# Altium project Logic.PrjPcb
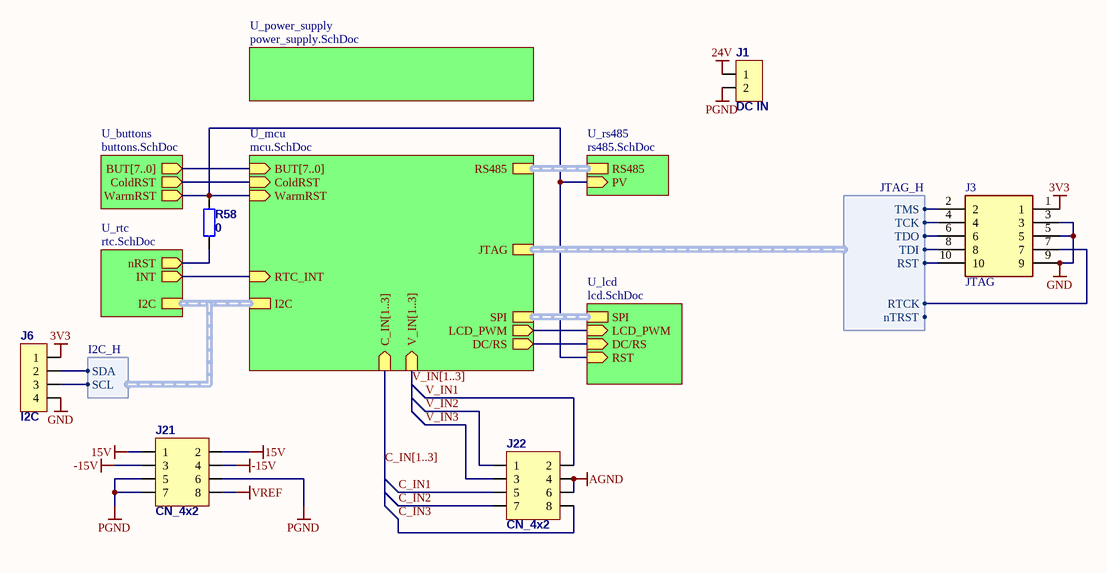
[diagram p0: main.SchDoc]
7 sheets, 162 parts. Net scope: hierarchical (ports join the sheet entries above them; power ports are global).
Board file: PCB1.PcbDoc
Sheets:
  main.SchDoc
    U_buttons = buttons.SchDoc
    U_mcu = mcu.SchDoc
    U_power_supply = power_supply.SchDoc
    U_rs485 = rs485.SchDoc
    U_rtc = rtc.SchDoc
    U_lcd = lcd.SchDoc

## Sheet main.SchDoc
size A4

### Parts
J1  DC IN  [15EDGRC-3.81/2P_WO_CN]
J3  JTAG  [FTSH-105-XX-YYY-DV-K-P-TR]
J6  I2C  [GP_4x1]
J21  CN_4x2  [GP_4x2]
J22  CN_4x2  [GP_4x2]
R58  0  [R0603]

### Sub-sheets
U_buttons = buttons.SchDoc: BUT[7..0] (out), ColdRST (out), WarmRST (out)
U_lcd = lcd.SchDoc: SPI (harness SPI_H), LCD_PWM (in), DC/RS (in), RST (in)
U_mcu = mcu.SchDoc: BUT[7..0] (in), I2C (harness I2C_H), JTAG (harness JTAG_H), SPI (harness SPI_H), RS485 (harness RS485_H), V_IN[1..3] (in), C_IN[1..3] (in), ColdRST (in), WarmRST (in), RTC_INT (in), LCD_PWM (out), DC/RS (out)
U_power_supply = power_supply.SchDoc: no entries
U_rs485 = rs485.SchDoc: PV (in), RS485 (harness RS485_H)
U_rtc = rtc.SchDoc: nRST (out), INT (out), I2C (harness I2C_H)

### Harnesses
JTAG_H: nTRST, RST, RTCK, TCK, TDI, TDO, TMS
I2C_H: SCL, SDA

### Nets
3V3: J3.1 J6.1
15V: J21.1 J21.2
24V: J1.1
-15V: J21.3 J21.4
AGND: J22.4 J22.6  [project net ADC_REF_L]
GND: J3.3 J3.5 J3.9 J6.4  [project net VSS]
PGND: J1.2 J21.5 J21.6 J21.7
VREF: J21.8
C_IN1: J22.5
C_IN2: J22.7
C_IN3: J22.8
DC/RS: sheet U_mcu/DC/RS, sheet U_lcd/DC/RS
LCD_PWM: sheet U_mcu/LCD_PWM, sheet U_lcd/LCD_PWM
nRST: J3.10 R58.2 ; sheet U_buttons/WarmRST, sheet U_mcu/WarmRST, sheet U_rs485/PV, sheet U_lcd/RST, sheet U_mcu/JTAG.RST
RTC_INT: sheet U_mcu/RTC_INT, sheet U_rtc/INT
TCK: J3.4 ; sheet U_mcu/JTAG.TCK
TDI: J3.8 ; sheet U_mcu/JTAG.TDI
TMS: J3.2 ; sheet U_mcu/JTAG.TMS
V_IN1: J22.2
V_IN2: J22.1
V_IN3: J22.3
NetColdRST_2: sheet U_buttons/ColdRST, sheet U_mcu/ColdRST
NetJ3_6: J3.6 ; sheet U_mcu/JTAG.TDO
NetJ3_7: J3.7 ; sheet U_mcu/JTAG.RTCK
NetJ6_2: J6.2 ; sheet U_mcu/I2C.SDA
NetJ6_3: J6.3 ; sheet U_mcu/I2C.SCL
NetR58_1: R58.1 ; sheet U_rtc/nRST

### Buses and harness runs
bus C_IN[1..3] = sheet U_mcu/C_IN[1..3]
bus sheet U_buttons/BUT[7..0] = sheet U_mcu/BUT[7..0]
bus V_IN[1..3] = sheet U_mcu/V_IN[1..3]
harness sheet U_lcd/SPI = sheet U_mcu/SPI
harness sheet U_mcu/I2C = sheet U_rtc/I2C
harness sheet U_mcu/RS485 = sheet U_rs485/RS485

### Library data of the parts
J1 = CN_2x1
J3 = FTSH-105-01-L-DV-K-P-TR: Connector; Manufacturer_Name: SAMTEC; Datasheet Link: http://suddendocs.samtec.com/prints/ftsh-1xx-xx-xxx-dv-xxx-xxx-mkt.pdf; Manufacturer_Part_Number: FTSH-105-01-L-DV-K-P-TR
J6 = CN_4x1
R58 = Res: Resistor; Published: 19-Feb-2006; ComponentLink1Description: datasheet; ComponentLink2Description: supplier; Value: 0

## Sheet buttons.SchDoc
size A4
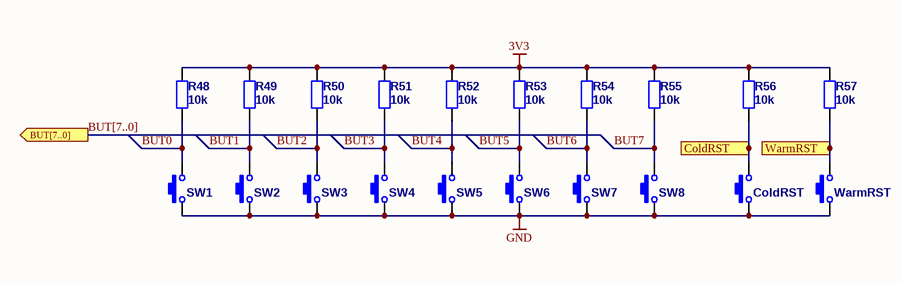
[diagram p1: buttons.SchDoc]

### Parts
ColdRST  TACTM-67N-F  [DTSM-6]  (value not drawn)
R48  10k  [R0603]
R49  10k  [R0603]
R50  10k  [R0603]
R51  10k  [R0603]
R52  10k  [R0603]
R53  10k  [R0603]
R54  10k  [R0603]
R55  10k  [R0603]
R56  10k  [R0603]
R57  10k  [R0603]
SW1  TACTM-67N-F  [DTSM-6]  (value not drawn)
SW2  TACTM-67N-F  [DTSM-6]  (value not drawn)
SW3  TACTM-67N-F  [DTSM-6]  (value not drawn)
SW4  TACTM-67N-F  [DTSM-6]  (value not drawn)
SW5  TACTM-67N-F  [DTSM-6]  (value not drawn)
SW6  TACTM-67N-F  [DTSM-6]  (value not drawn)
SW7  TACTM-67N-F  [DTSM-6]  (value not drawn)
SW8  TACTM-67N-F  [DTSM-6]  (value not drawn)
WarmRST  TACTM-67N-F  [DTSM-6]  (value not drawn)

### Ports
BUT[7..0] (out), ColdRST (out), WarmRST (out)

### Nets
3V3: R48.2 R49.2 R50.2 R51.2 R52.2 R53.2 R54.2 R55.2 R56.2 R57.2
GND: ColdRST.1 SW1.1 SW2.1 SW3.1 SW4.1 SW5.1 SW6.1 SW7.1 SW8.1 WarmRST.1  [project net VSS]
BUT0: R48.1 SW1.2
BUT1: R49.1 SW2.2
BUT2: R50.1 SW3.2
BUT3: R51.1 SW4.2
BUT4: R52.1 SW5.2
BUT5: R53.1 SW6.2
BUT6: R54.1 SW7.2
BUT7: R55.1 SW8.2
nRST: R57.1 WarmRST.2 ; port WarmRST
NetColdRST_2: ColdRST.2 R56.1 ; port ColdRST

### Buses and harness runs
bus BUT[7..0] = port BUT[7..0]

### Library data of the parts
ColdRST SW1-SW8 WarmRST = TACTM-67N-F: 6x6mm SMD Tactile SPST-NO Switch
R48-R57 = Res: Resistor; Published: 19-Feb-2006; ComponentLink1Description: datasheet; ComponentLink2Description: supplier; Value: 10k

## Sheet mcu.SchDoc
size A3
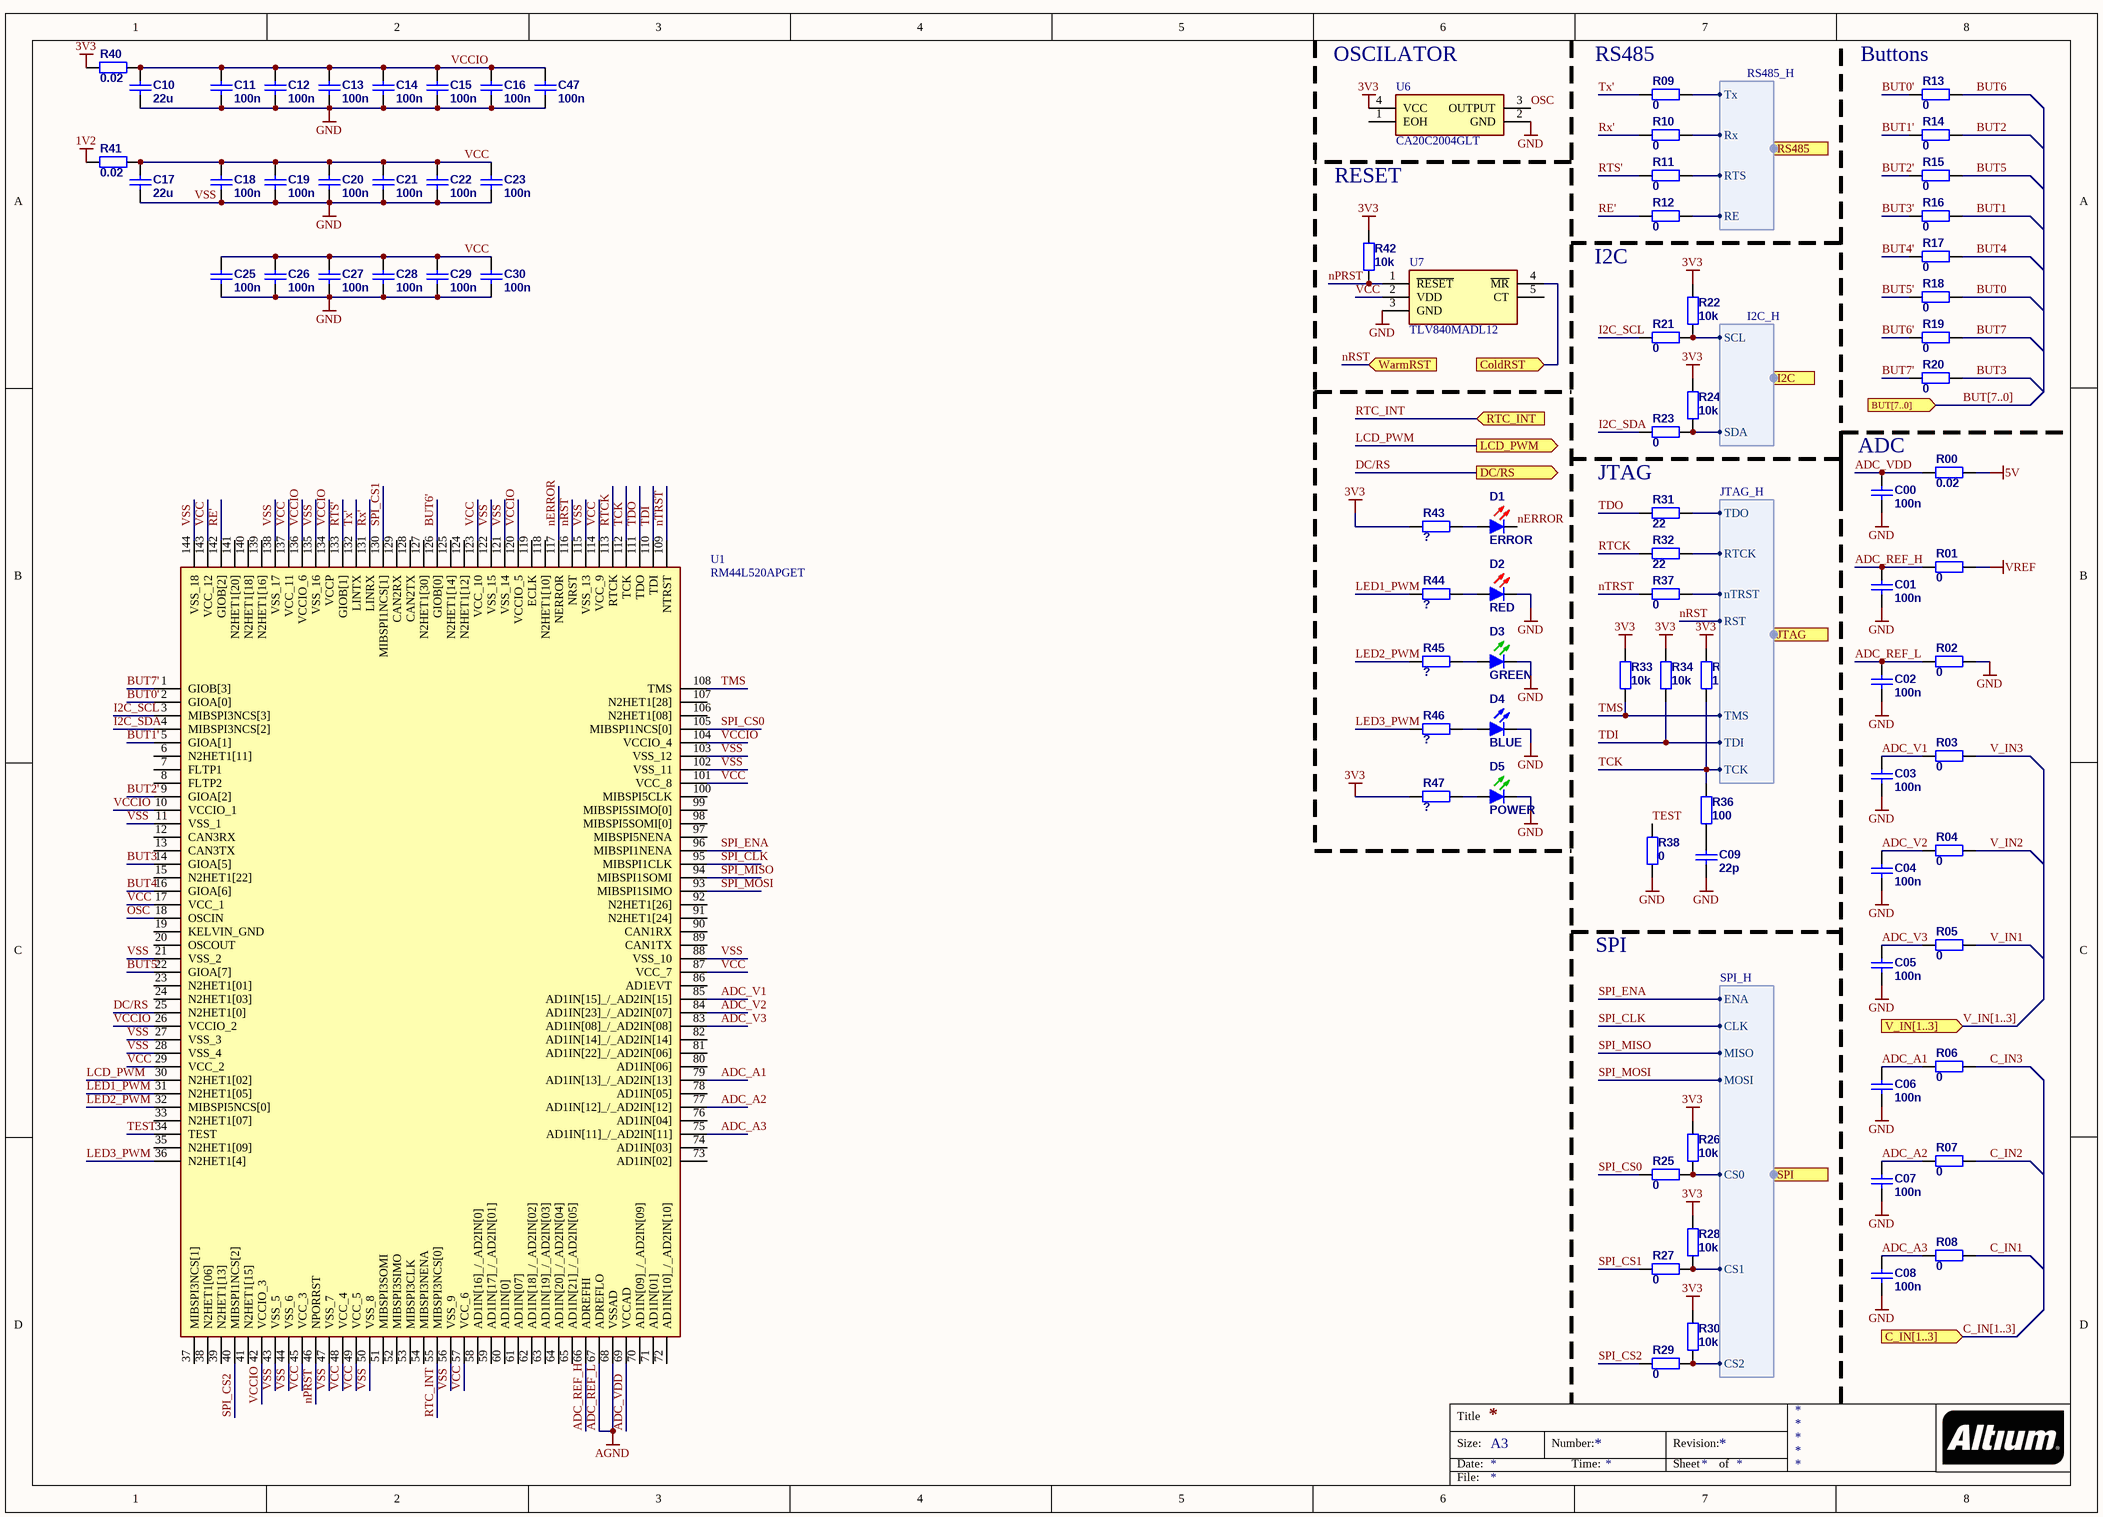
[diagram p2: mcu.SchDoc]

### Parts
C00  100n  [C0402]
C01  100n  [C0402]
C02  100n  [C0402]
C03  100n  [C0402]
C04  100n  [C0402]
C05  100n  [C0402]
C06  100n  [C0402]
C07  100n  [C0402]
C08  100n  [C0402]
C09  22p  [C0402]
C10  22u  [C0603]
C11  100n  [C0402]
C12  100n  [C0402]
C13  100n  [C0402]
C14  100n  [C0402]
C15  100n  [C0402]
C16  100n  [C0402]
C17  22u  [C0603]
C18  100n  [C0402]
C19  100n  [C0402]
C20  100n  [C0402]
C21  100n  [C0402]
C22  100n  [C0402]
C23  100n  [C0402]
C25  100n  [C0402]
C26  100n  [C0402]
C27  100n  [C0402]
C28  100n  [C0402]
C29  100n  [C0402]
C30  100n  [C0402]
C47  100n  [C0402]
D1  ERROR  [LED1206R]
D2  RED  [LED1206R]
D3  GREEN  [LED1206G]
D4  BLUE  [LED1206B]
D5  POWER  [LED1206G]
R00  0.02  [R0402]
R01  0  [R0402]
R02  0  [R0402]
R03  0  [R0402]
R04  0  [R0402]
R05  0  [R0402]
R06  0  [R0402]
R07  0  [R0402]
R08  0  [R0402]
R09  0  [R0402]
R10  0  [R0402]
R11  0  [R0402]
R12  0  [R0402]
R13  0  [R0402]
R14  0  [R0402]
R15  0  [R0402]
R16  0  [R0402]
R17  0  [R0402]
R18  0  [R0402]
R19  0  [R0402]
R20  0  [R0402]
R21  0  [R0402]
R22  10k  [R0402]
R23  0  [R0402]
R24  10k  [R0402]
R25  0  [R0402]
R26  10k  [R0402]
R27  0  [R0402]
R28  10k  [R0402]
R29  0  [R0402]
R30  10k  [R0402]
R31  22  [R0402]
R32  22  [R0402]
R33  10k  [R0402]
R34  10k  [R0402]
R35  10k  [R0402]
R36  100  [R0402]
R37  0  [R0402]
R38  0  [R0402]
R40  0.02  [R0603]
R41  0.02  [R0603]
R42  10k  [R0402]
R43  ?  [R0603]
R44  ?  [R0402]
R45  ?  [R0402]
R46  ?  [R0402]
R47  ?  [R0603]
U1  RM44L520APGET  [QFP50P2200X2200X160-144N]
U6  CA20C2004GLT  [CA20C2004GLT]
U7  TLV840MADL12  [SOT95P280X145-5N]

### Ports
BUT[7..0] (in), C_IN[1..3] (in), ColdRST (in), DC/RS (out), I2C (in, harness I2C_H), JTAG (in, harness JTAG_H), LCD_PWM (out), RS485 (in, harness RS485_H), RTC_INT (in), SPI (in, harness SPI_H), V_IN[1..3] (in), WarmRST (in)

### Harnesses
RS485_H: Tx, Rx, RTS, RE
I2C_H: SCL, SDA
JTAG_H: TDO, RTCK, nTRST, TMS, TCK, TDI, RST
SPI_H: ENA, CLK, MISO, MOSI, CS0, CS1, CS2

### Nets
1V2: R41.1
3V3: R22.2 R24.1 R26.2 R28.2 R30.1 R33.2 R34.2 R35.2 R40.1 R42.2 R43.2 R47.2 U6.4(VCC)
5V: R00.2
ADC_REF_L: C02.2 R02.1 U1.67(ADREFLO) U1.68(VSSAD)  [also labelled AGND]
VREF: R01.2
VSS: C00.1 C01.1 C02.1 C03.1 C04.1 C05.1 C06.1 C07.1 C08.1 C09.1 C10.1 C11.1 C12.1 C13.1 C14.1 C15.1 C16.1 C17.1 C18.1 C19.1 C20.1 C21.1 C22.1 C23.1 C25.1 C26.1 C27.1 C28.1 C29.1 C30.1 C47.1 D2.2(K) D3.2(K) D4.2(K) D5.2(K) R02.2 R38.1 U1.11(VSS_1) U1.21(VSS_2) U1.27(VSS_3) U1.28(VSS_4) U1.43(VSS_5) U1.44(VSS_6) U1.47(VSS_7) U1.50(VSS_8) U1.56(VSS_9) U1.88(VSS_10) U1.102(VSS_11) U1.103(VSS_12) U1.115(VSS_13) U1.121(VSS_14) U1.122(VSS_15) U1.135(VSS_16) U1.138(VSS_17) U1.144(VSS_18) U6.2(GND) U7.3(GND)  [also labelled GND]
ADC_A1: C06.2 R06.1 U1.79(AD1IN[13]_/_AD2IN[13])
ADC_A2: C07.2 R07.1 U1.77(AD1IN[12]_/_AD2IN[12])
ADC_A3: C08.2 R08.1 U1.75(AD1IN[11]_/_AD2IN[11])
ADC_REF_H: C01.2 R01.1 U1.66(ADREFHI)
ADC_V1: C03.2 R03.1 U1.85(AD1IN[15]_/_AD2IN[15])
ADC_V2: C04.2 R04.1 U1.84(AD1IN[23]_/_AD2IN[07])
ADC_V3: C05.2 R05.1 U1.83(AD1IN[08]_/_AD2IN[08])
ADC_VDD: C00.2 R00.1 U1.69(VCCAD)
BUT0: R18.2
BUT0': R13.1 U1.2(GIOA[0])
BUT1: R16.2
BUT1': R14.1 U1.5(GIOA[1])
BUT2: R14.2
BUT2': R15.1 U1.9(GIOA[2])
BUT3: R20.2
BUT3': R16.1 U1.14(GIOA[5])
BUT4: R17.2
BUT4': R17.1 U1.16(GIOA[6])
BUT5: R15.2
BUT5': R18.1 U1.22(GIOA[7])
BUT6: R13.2
BUT6': R19.1 U1.126(GIOB[0])
BUT7: R19.2
BUT7': R20.1 U1.1(GIOB[3])
C_IN1: R08.2
C_IN2: R07.2
C_IN3: R06.2
DC/RS: U1.25(N2HET1[0]) ; port DC/RS
I2C_SCL: R21.1 U1.3(MIBSPI3NCS[3])
I2C_SDA: R23.2 U1.4(MIBSPI3NCS[2])
LCD_PWM: U1.30(N2HET1[02]) ; port LCD_PWM
LED1_PWM: R44.2 U1.31(N2HET1[05])
LED2_PWM: R45.2 U1.32(MIBSPI5NCS[0])
LED3_PWM: R46.2 U1.36(N2HET1[4])
nERROR: D1.2(K) U1.117(NERROR)
nPRST: R42.1 U1.46(NPORRST) U7.1(~{RESET})
nRST: U1.116(NRST) ; port WarmRST, port JTAG.RST
nTRST: R37.1 U1.109(NTRST)
OSC: U1.18(OSCIN) U6.3(OUTPUT)
RE': R12.1 U1.142(GIOB[2])
RTC_INT: U1.55(MIBSPI3NCS[0]) ; port RTC_INT
RTCK: R32.1 U1.113(RTCK)
RTS': R11.1 U1.133(GIOB[1])
Rx': R10.1 U1.131(LINRX)
SPI_CLK: U1.95(MIBSPI1CLK) ; port SPI.CLK
SPI_CS0: R25.1 U1.105(MIBSPI1NCS[0])
SPI_CS1: R27.2 U1.130(MIBSPI1NCS[1])
SPI_CS2: R29.2 U1.40(MIBSPI1NCS[2])
SPI_ENA: U1.96(MIBSPI1NENA) ; port SPI.ENA
SPI_MISO: U1.94(MIBSPI1SOMI) ; port SPI.MISO
SPI_MOSI: U1.93(MIBSPI1SIMO) ; port SPI.MOSI
TCK: R35.1 R36.2 U1.112(TCK) ; port JTAG.TCK
TDI: R34.1 U1.110(TDI) ; port JTAG.TDI
TDO: R31.1 U1.111(TDO)
TEST: R38.2 U1.34(TEST)
TMS: R33.1 U1.108(TMS) ; port JTAG.TMS
Tx': R09.1 U1.132(LINTX)
V_IN1: R05.2
V_IN2: R04.2
V_IN3: R03.2
VCC: C17.2 C18.2 C19.2 C20.2 C21.2 C22.2 C23.2 C25.2 C26.2 C27.2 C28.2 C29.2 C30.2 R41.2 U1.17(VCC_1) U1.29(VCC_2) U1.45(VCC_3) U1.48(VCC_4) U1.49(VCC_5) U1.57(VCC_6) U1.87(VCC_7) U1.101(VCC_8) U1.114(VCC_9) U1.123(VCC_10) U1.137(VCC_11) U1.143(VCC_12) U7.2(VDD)
VCCIO: C10.2 C11.2 C12.2 C13.2 C14.2 C15.2 C16.2 C47.2 R40.2 U1.10(VCCIO_1) U1.26(VCCIO_2) U1.42(VCCIO_3) U1.104(VCCIO_4) U1.120(VCCIO_5) U1.134(VCCP) U1.136(VCCIO_6)
NetC09_2: C09.2 R36.1
NetColdRST_2: U7.4(~{MR}) ; port ColdRST
NetD1_1: D1.1(A) R43.1
NetD2_1: D2.1(A) R44.1
NetD3_1: D3.1(A) R45.1
NetD4_1: D4.1(A) R46.1
NetD5_1: D5.1(A) R47.1
NetJ3_6: R31.2 ; port JTAG.TDO
NetJ3_7: R32.2 ; port JTAG.RTCK
NetJ5_3: R25.2 R26.1 ; port SPI.CS0
NetJ6_2: R23.1 R24.2 ; port I2C.SDA
NetJ6_3: R21.2 R22.1 ; port I2C.SCL
NetR09_2: R09.2 ; port RS485.Tx
NetR10_2: R10.2 ; port RS485.Rx
NetR11_2: R11.2 ; port RS485.RTS
NetR12_2: R12.2 ; port RS485.RE
NetR27_1: R27.1 R28.1 ; port SPI.CS1
NetR29_1: R29.1 R30.2 ; port SPI.CS2
NetR37_2: R37.2 ; port JTAG.nTRST

Not connected (* = marked no-connect by the designer): U1 6(N2HET1[11]) 7(FLTP1) 8(FLTP2) 12(CAN3RX) 13(CAN3TX) 15(N2HET1[22]) 19(KELVIN_GND) 20(OSCOUT) 23(N2HET1[01]) 24(N2HET1[03]) 33(N2HET1[07]) 35(N2HET1[09]) 37(MIBSPI3NCS[1]) 38(N2HET1[06]) 39(N2HET1[13]) 41(N2HET1[15]) 51(MIBSPI3SOMI) 52(MIBSPI3SIMO) 53(MIBSPI3CLK) 54(MIBSPI3NENA) 58(AD1IN[16]_/_AD2IN[0]) 59(AD1IN[17]_/_AD2IN[01]) 60(AD1IN[0]) 61(AD1IN[07]) 62(AD1IN[18]_/_AD2IN[02]) 63(AD1IN[19]_/_AD2IN[03]) 64(AD1IN[20]_/_AD2IN[04]) 65(AD1IN[21]_/_AD2IN[05]) 70(AD1IN[09]_/_AD2IN[09]) 71(AD1IN[01]) 72(AD1IN[10]_/_AD2IN[10]) 73(AD1IN[02]) 74(AD1IN[03]) 76(AD1IN[04]) 78(AD1IN[05]) 80(AD1IN[06]) 81(AD1IN[22]_/_AD2IN[06]) 82(AD1IN[14]_/_AD2IN[14]) 86(AD1EVT) 89(CAN1TX) 90(CAN1RX) 91(N2HET1[24]) 92(N2HET1[26]) 97(MIBSPI5NENA) 98(MIBSPI5SOMI[0]) 99(MIBSPI5SIMO[0]) 100(MIBSPI5CLK) 106(N2HET1[08]) 107(N2HET1[28]) 118(N2HET1[10]) 119(ECLK) 124(N2HET1[12]) 125(N2HET1[14]) 127(N2HET1[30]) 128(CAN2TX) 129(CAN2RX) 139(N2HET1[16]) 140(N2HET1[18]) 141(N2HET1[20]); U6 1(EOH); U7 5(CT)

### Buses and harness runs
bus BUT[7..0] = port BUT[7..0]
bus C_IN[1..3] = port C_IN[1..3]
bus V_IN[1..3] = port V_IN[1..3]

### Notes on the sheet
- (near U6) OSCILATOR
- (near R09) RS485
- (near R13) Buttons
- RESET
- (near R12) I2C
- ADC
- JTAG
- SPI
- Title
- Size:
- Date:
- A3
- Number:
- Time:
- Revision:
- Sheet
- of
- File:

### Library data of the parts
C00 C01 C02 C03 C04 C05 C06 C07 C08 C09-C23 C25-C30 C47 = Cap: Capacitor; ComponentLink1Description: datasheet; ComponentLink2Description: supplier
  C00 C01 C02 C03 C04 C05 C06 C07 C08 C11-C16 C18-C23 C25-C30 C47: Value: 100n
  C09: Value: 22p
  C10 C17: Value: 22u
D1 D2 = LED_RED: RED LED; Published: 04-Apr-2006
D3 D5 = LED_GREEN: GREEN LED; Published: 04-Apr-2006
D4 = LED_BLUE: BLUE LED; Published: 04-Apr-2006
R00 R01 R02 R03 R04 R05 R06 R07 R08 R09-R38 R40-R47 = Res: Resistor; Published: 19-Feb-2006; ComponentLink1Description: datasheet; ComponentLink2Description: supplier
  R00 R40 R41: Value: 0.02
  R01 R02 R03 R04 R05 R06 R07 R08 R09-R21 R23 R25 R27 R29 R37 R38: Value: 0
  R22 R24 R26 R28 R30 R33-R35 R42: Value: 10k
  R31 R32: Value: 22
  R36: Value: 100
  R43-R47: Value: ?
U1 = RM44L520APGET: Integrated Circuit; Manufacturer_Name: Texas Instruments; Datasheet Link: http://www.ti.com/lit/gpn/rm44l520; Height: 1.6mm; Mouser2 Part Number: 595-RM44L520APGET; Mouser2 Price/Stock: https://www.mouser.com/Search/Refine.aspx?Keyword=595-RM44L520APGET; Manufacturer_Part_Number: RM44L520APGET
U6 = CA20C2004GLT: Crystal or Oscillator; Manufacturer_Name: CTS; Datasheet Link: https://componentsearchengine.com//CA20C2004GLT.pdf; Height: 0.8mm; Mouser2 Part Number: 774-CA20C2004GLT; Mouser2 Price/Stock: https://www.mouser.com/Search/Refine.aspx?Keyword=774-CA20C2004GLT; Manufacturer_Part_Number: CA20C2004GLT
U7 = TLV840MAPL36DBVRQ1: Integrated Circuit; Manufacturer_Name: Texas Instruments; Datasheet Link: https://www.ti.com/lit/gpn/TLV840-Q1; Height: 1.45mm; Manufacturer_Part_Number: TLV840MAPL36DBVRQ1

## Sheet power_supply.SchDoc
size A4
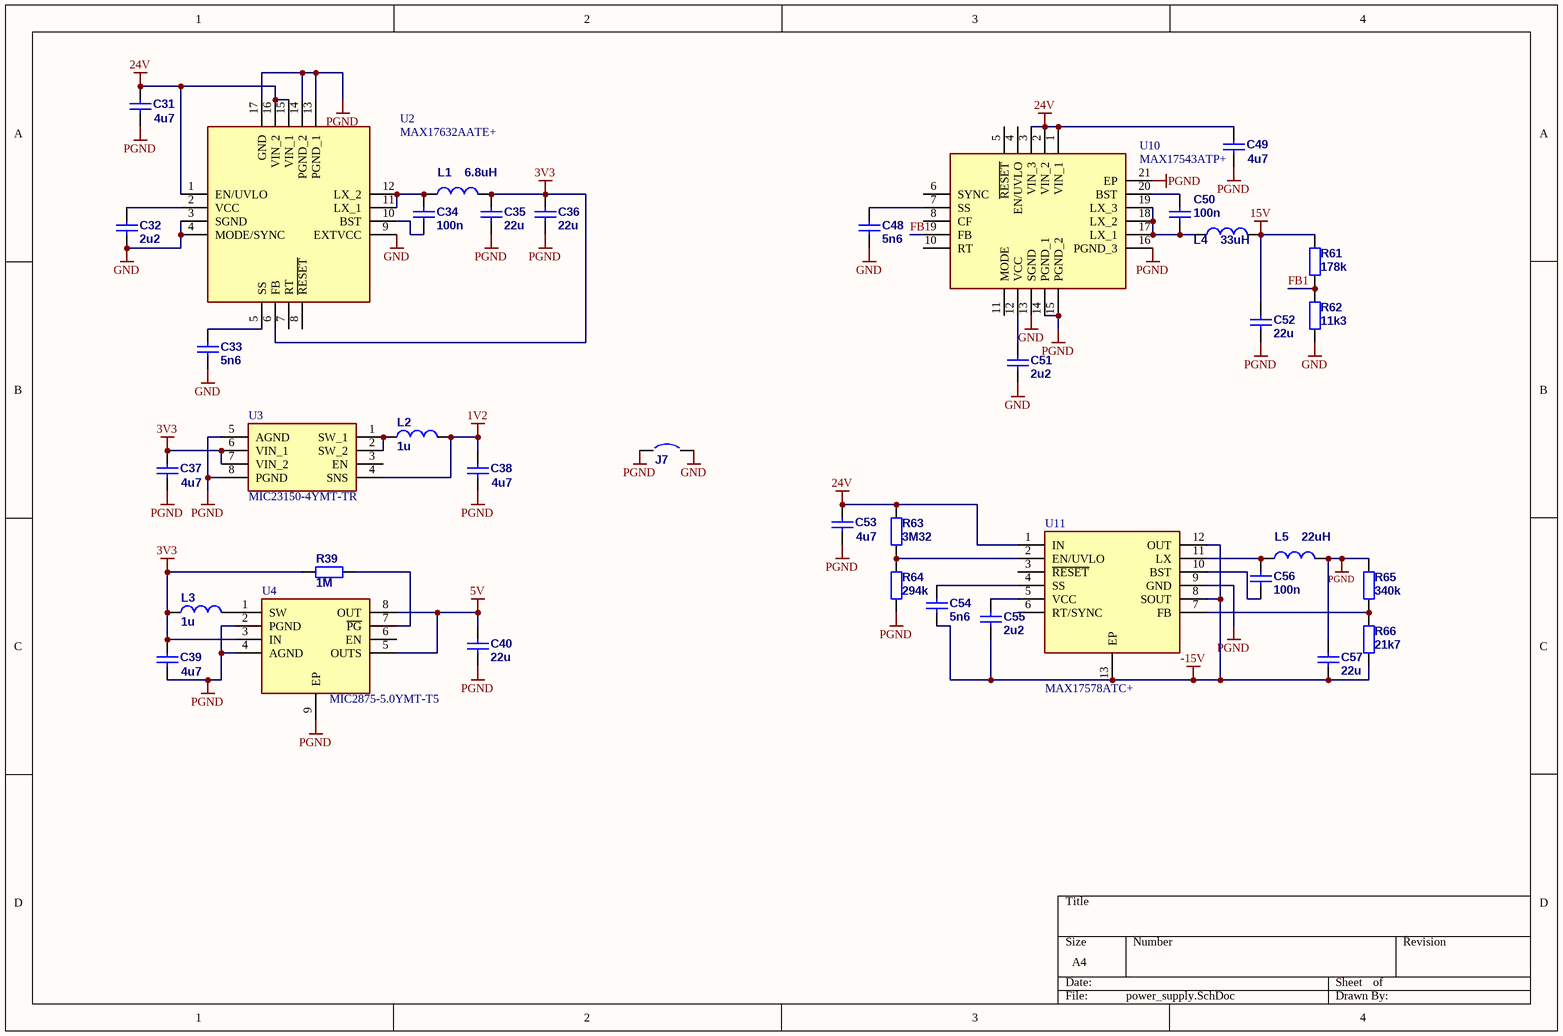
[diagram p3: power_supply.SchDoc]

### Parts
C31  4u7  [C1206]
C32  2u2  [C0603]
C33  5n6  [C0603]
C34  100n  [C0603]
C35  22u  [C1206]
C36  22u  [C1206]
C37  4u7  [C1206]
C38  4u7  [C1206]
C39  4u7  [C1206]
C40  22u  [C1206]
C48  5n6  [C0603]
C49  4u7  [C1206]
C50  100n  [C0603]
C51  2u2  [C0603]
C52  22u  [C1206]
C53  4u7  [C1206]
C54  5n6  [C0603]
C55  2u2  [C0603]
C56  100n  [C0603]
C57  22u  [C1206]
J7  Circuit Breaker  [JMP2_0805_N_NC]  (value not drawn)
L1  6.8uH  [DE1205]
L2  1u  [L1210]
L3  1u  [L1210]
L4  33uH  [DE1205]
L5  22uH  [DE1205]
R39  1M  [R0603]
R61  178k  [R0603]
R62  11k3  [R0603]
R63  3M32  [R0603]
R64  294k  [R0603]
R65  340k  [R0603]
R66  21k7  [R0603]
U2  MAX17632AATE+  [QFN50P300X300X80-17N]
U3  MIC23150-4YMT-TR  [MIC231504YMTTR]
U4  MIC2875-5.0YMT-T5  [SON50P200X200X60-9N-D]
U10  MAX17543ATP+  [QFN50P400X400X80-21N]
U11  MAX17578ATC+  [SON50P300X300X80-13N]

### Nets
1V2: C38.2 L2.2 U3.4(SNS)
3V3: C35.2 C36.2 C37.2 C39.2 L1.2 L3.1 R39.1 U2.6(FB) U3.6(VIN_1) U3.7(VIN_2) U4.3(IN)
5V: C40.2 U4.5(OUTS) U4.8(OUT)
15V: C52.2 L4.2 R61.2
24V: C31.2 C49.2 C53.2 R63.2 U2.1(EN/UVLO) U2.15(VIN_1) U2.16(VIN_2) U10.1(VIN_1) U10.2(VIN_2) U10.3(VIN_3) U11.1(IN)
-15V: C54.1 C55.1 C57.1 R66.1 U11.8(SOUT) U11.12(OUT) U11.13(EP)
GND: C32.1 C33.1 C48.1 C51.1 J7.2 R62.1 U2.3(SGND) U2.4(MODE/SYNC) U2.9(EXTVCC) U10.13(SGND)  [project net VSS]
PGND: C31.1 C35.1 C36.1 C37.1 C38.1 C39.1 C40.1 C49.1 C52.1 C53.1 C57.2 J7.1 L5.2 R64.1 R65.2 U2.13(PGND_1) U2.14(PGND_2) U2.17(GND) U3.5(AGND) U3.8(PGND) U4.2(PGND) U4.4(AGND) U4.9(EP) U10.14(PGND_1) U10.15(PGND_2) U10.16(PGND_3) U10.21(EP) U11.9(GND)
FB1: R61.1 R62.2 U10.9(FB)
NetC32_2: C32.2 U2.2(VCC)
NetC33_2: C33.2 U2.5(SS)
NetC34_1: C34.1 L1.1 U2.11(LX_1) U2.12(LX_2)
NetC34_2: C34.2 U2.10(BST)
NetC48_2: C48.2 U10.7(SS)
NetC50_1: C50.1 L4.1 U10.17(LX_1) U10.18(LX_2) U10.19(LX_3)
NetC50_2: C50.2 U10.20(BST)
NetC51_2: C51.2 U10.12(VCC)
NetC54_2: C54.2 U11.4(SS)
NetC55_2: C55.2 U11.5(VCC)
NetC56_1: C56.1 L5.1 U11.11(LX)
NetC56_2: C56.2 U11.10(BST)
NetL2_1: L2.1 U3.1(SW_1) U3.2(SW_2)
NetL3_2: L3.2 U4.1(SW)
NetR39_2: R39.2 U4.7(~{PG})
NetR63_1: R63.1 R64.2 U11.2(EN/UVLO)
NetR65_1: R65.1 R66.2 U11.7(FB)

Not connected (* = marked no-connect by the designer): U2 7(RT) 8(~{RESET}); U3 3(EN); U4 6(EN); U10 4(EN/UVLO) 5(~{RESET}) 6(SYNC) 8(CF) 10(RT) 11(MODE); U11 3(~{RESET}) 6(RT/SYNC)

### Library data of the parts
C31-C40 C48-C57 = Cap: Capacitor; ComponentLink1Description: datasheet; ComponentLink2Description: supplier
  C31 C37-C39 C49 C53: Value: 4u7
  C32 C51 C55: Value: 2u2
  C33 C48 C54: Value: 5n6
  C34 C50 C56: Value: 100n
  C35 C36 C40 C52 C57: Value: 22u
J7 = Circuit Breaker: Solder: NO; Published: 24-Mar-1999; Revision: July-2002: Re-released for DXP Platform.; Publisher: Altium Limited
L1 = DE1205-10: Published: 08-Mar-2006; ComponentLink1Description: datasheet; ComponentLink2Description: supplier; Supplier 1: TME; Supplier Part Number 1: DE1205-10; Value: 6.8uH
L2 L3 = Ind: Inductor; Published: 08-Mar-2006; ComponentLink1Description: datasheet; ComponentLink2Description: supplier; value: 1u
L4 L5 = DE1205-22: Published: 08-Mar-2006; ComponentLink1Description: datasheet; ComponentLink2Description: supplier; Supplier 1: TME; Supplier Part Number 1: DE1205-22
  L4: Value: 33uH
  L5: Value: 22uH
R39 R61-R66 = Res: Resistor; Published: 19-Feb-2006; ComponentLink1Description: datasheet; ComponentLink2Description: supplier
  R39: Value: 1M
  R61: Value: 178k
  R62: Value: 11k3
  R63: Value: 3M32
  R64: Value: 294k
  R65: Value: 340k
  R66: Value: 21k7
U2 = MAX17632AATE+: Integrated Circuit; Manufacturer_Name: Maxim Integrated; Datasheet Link: https://datasheets.maximintegrated.com/en/ds/MAX17632.pdf; Height: 0.8mm; Manufacturer_Part_Number: MAX17632AATE+
U3 = MIC23150-4YMT-TR: Integrated Circuit; Manufacturer_Name: Microchip; Datasheet Link: https://ww1.microchip.com/downloads/en/DeviceDoc/mic23150.pdf; Height: 0.6mm; Manufacturer_Part_Number: MIC23150-4YMT-TR; Mouser Part Number: 998-MIC23150-4YMTTR; Mouser Price/Stock: https://www.mouser.co.uk/ProductDetail/Microchip-Technology-Micrel/MIC23150-4YMT-TR?qs=Y3Q3JoKAO1Sp7WXfkXLXrw%3D%3D; Arrow Part Number: MIC23150-4YMT-TR; Arrow Price/Stock: https://www.arrow.com/en/products/mic23150-4ymt-tr/microchip-technology?region=nac
U4 = MIC2875-5.0YMT-T5: Integrated Circuit; Manufacturer_Name: Microchip; Datasheet Link: http://ww1.microchip.com/downloads/en/DeviceDoc/20005549A.pdf; Height: 0.6mm; Manufacturer_Part_Number: MIC2875-5.0YMT-T5
U10 = MAX17543ATP+: Integrated Circuit; Manufacturer_Name: Maxim Integrated; Datasheet Link: https://pdfserv.maximintegrated.com/en/ds/MAX17543.pdf; Height: 0.8mm; Manufacturer_Part_Number: MAX17543ATP+
U11 = MAX17578ATC+: Integrated Circuit; Manufacturer_Name: Maxim Integrated; Datasheet Link: https://datasheets.maximintegrated.com/en/ds/MAX17577-MAX17578.pdf; Height: 0.8mm; Manufacturer_Part_Number: MAX17578ATC+

## Sheet rs485.SchDoc
size A4
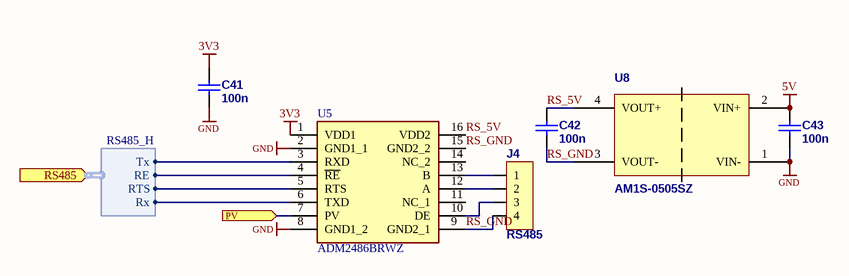
[diagram p4: rs485.SchDoc]

### Parts
C41  100n  [C0805]
C42  100n  [C0805]
C43  100n  [C0805]
J4  RS485  [15EDGRC-3.81/4P_WO_CN]
U5  ADM2486BRWZ  [SOIC127P1032X265-16N]
U8  AM1S-0505SZ  [AM1S-Z]

### Ports
PV (in), RS485 (in, harness RS485_H)

### Harnesses
RS485_H: RE, RTS, Rx, Tx

### Nets
3V3: C41.2 U5.1(VDD1)
5V: C43.1 U8.2(VIN+)
GND: C41.1 C43.2 U5.2(GND1_1) U5.8(GND1_2) U8.1(VIN-)  [project net VSS]
nRST: U5.7(PV) ; port PV
RS_5V: C42.2 U5.16(VDD2) U8.4(VOUT+)
RS_GND: C42.1 J4.4 U5.9(GND2_1) U5.15(GND2_2) U8.3(VOUT-)
NetJ4_1: J4.1 U5.13(B)
NetJ4_2: J4.2 U5.12(A)
NetJ4_3: J4.3 U5.10(DE)
NetR09_2: U5.3(RXD) ; port RS485.Tx
NetR10_2: U5.6(TXD) ; port RS485.Rx
NetR11_2: U5.5(RTS) ; port RS485.RTS
NetR12_2: U5.4(~{RE}) ; port RS485.RE

Not connected (* = marked no-connect by the designer): U5 11(NC_1) 14(NC_2)

### Library data of the parts
C41-C43 = Cap: Capacitor; ComponentLink1Description: datasheet; ComponentLink2Description: supplier; Value: 100n
J4 = 2EDGVC-5.0-4P: Degson 20A, 320V, 4 Pole Plug-in Terminal Block
U5 = ADM2486BRWZ: Integrated Circuit; Manufacturer_Name: Analog Devices; Datasheet Link: http://componentsearchengine.com/Datasheets/1/ADM2486BRWZ.pdf; Height: 2.65mm; Manufacturer_Part_Number: ADM2486BRWZ; Mouser Part Number: 584-ADM2486BRWZ; Mouser Price/Stock: https://www.mouser.co.uk/ProductDetail/Analog-Devices/ADM2486BRWZ?qs=BpaRKvA4VqGSEWb6zK%252B8GA%3D%3D; Arrow Part Number: ADM2486BRWZ; Arrow Price/Stock: https://www.arrow.com/en/products/adm2486brwz/analog-devices?region=nac
U8 = AM1S-0505SZ: Aimtec 1Watt DC/DC Converter: 5V Input, 5V@200mA Output; ComponentLink1Description: Website; ComponentLink1URL: http://www.aimtec.com/; ComponentLink2Description: Datasheet; ComponentLink2URL: http://www.aimtec.com/site/Aimtec/files/Datasheet/HighResolution/AM1S-Z.pdf?ft4=6-889

## Sheet rtc.SchDoc
size A4
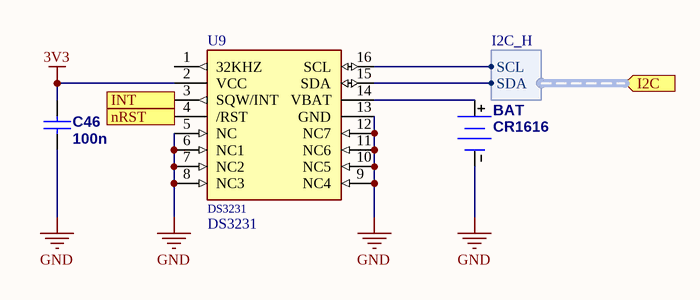
[diagram p5: rtc.SchDoc]

### Parts
BAT  CR1616  [KEYSTONE_3016]
C46  100n  [C0603]
U9  DS3231  [SO16W]

### Ports
I2C (in, harness I2C_H), INT (out), nRST (out)

### Harnesses
I2C_H: SCL, SDA

### Nets
3V3: C46.2 U9.2(VCC)
GND: BAT.2(-) C46.1 U9.5(NC) U9.6(NC1) U9.7(NC2) U9.8(NC3) U9.9(NC4) U9.10(NC5) U9.11(NC6) U9.12(NC7) U9.13(GND)  [project net VSS]
RTC_INT: U9.3(SQW/INT) ; port INT
NetBAT_1: BAT.1(+) U9.14(VBAT)
NetJ6_2: U9.15(SDA) ; port I2C.SDA
NetJ6_3: U9.16(SCL) ; port I2C.SCL
NetR58_1: U9.4(/RST) ; port nRST

Not connected (* = marked no-connect by the designer): U9 1(32KHZ)

### Library data of the parts
BAT = CR1616 Battery: Published: 24-Mar-1999; Revision: July-2002: Re-released for DXP Platform.; Publisher: Altium Limited
C46 = Cap: Capacitor; ComponentLink1Description: datasheet; ComponentLink2Description: supplier; Value: 100n
U9 = DS3231: å®žæ—¶æ—¶é’Ÿï¼ˆRTCï¼‰ICæ—¶é’Ÿ/æ—¥åŽ†IÂ²Cï¼Œ2çº¿ä¸²è¡Œ16-SOICï¼ˆ0.295â€œï¼Œ7.50mmå®½åº¦ï¼‰; MF: Maxim Integrated; Value: *; MP: DS3231; Package: SOIC-16 Maxim Integrated; Price: None; SnapEDA_Link: https://www.snapeda.com/parts/DS3231/Maxim%20Integrated/view-part/553791/?ref=snap; Availability: Unavailable

## Sheet lcd.SchDoc
size A4
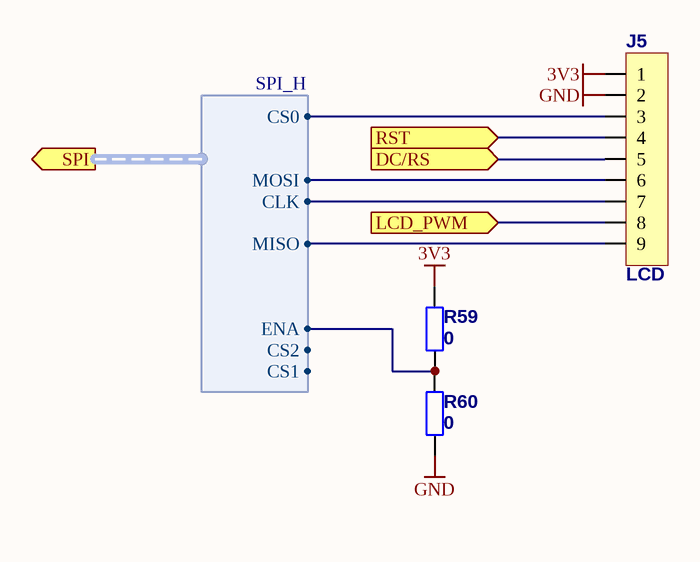
[diagram p6: lcd.SchDoc]

### Parts
J5  LCD  [GP_9x1H]
R59  0  [R0402]
R60  0  [R0402]

### Ports
DC/RS (in), LCD_PWM (in), RST (in), SPI (out, harness SPI_H)

### Harnesses
SPI_H: CLK, CS0, CS1, CS2, ENA, MISO, MOSI

### Nets
3V3: J5.1 R59.1
GND: J5.2 R60.2  [project net VSS]
DC/RS: J5.5 ; port DC/RS
LCD_PWM: J5.8 ; port LCD_PWM
nRST: J5.4 ; port RST
SPI_CLK: J5.7 ; port SPI.CLK
SPI_ENA: R59.2 R60.1 ; port SPI.ENA
SPI_MISO: J5.9 ; port SPI.MISO
SPI_MOSI: J5.6 ; port SPI.MOSI
NetJ5_3: J5.3 ; port SPI.CS0

### Library data of the parts
J5 = CN_9x1
R59 R60 = Res: Resistor; Published: 19-Feb-2006; ComponentLink1Description: datasheet; ComponentLink2Description: supplier; Value: 0

## Nets that join several sheets
1V2: mcu (R41.1), power_supply (C38.2 L2.2 U3.4)
3V3: main (J3.1 J6.1), buttons (10 pins), mcu (13 pins), power_supply (11 pins), rs485 (C41.2 U5.1), rtc (C46.2 U9.2), lcd (J5.1 R59.1)
5V: mcu (R00.2), power_supply (C40.2 U4.5 U4.8), rs485 (C43.1 U8.2)
15V: main (J21.1 J21.2), power_supply (C52.2 L4.2 R61.2)
24V: main (J1.1), power_supply (11 pins)
-15V: main (J21.3 J21.4), power_supply (7 pins)
ADC_REF_L: main (J22.4 J22.6), mcu (C02.2 R02.1 U1.67 U1.68)
PGND: main (J1.2 J21.5 J21.6 J21.7), power_supply (28 pins)
VREF: main (J21.8), mcu (R01.2)
VSS: main (J3.3 J3.5 J3.9 J6.4), buttons (10 pins), mcu (57 pins), power_supply (10 pins), rs485 (5 pins), rtc (11 pins), lcd (J5.2 R60.2)
BUT0: buttons (R48.1 SW1.2), mcu (R18.2)
BUT1: buttons (R49.1 SW2.2), mcu (R16.2)
BUT2: buttons (R50.1 SW3.2), mcu (R14.2)
BUT3: buttons (R51.1 SW4.2), mcu (R20.2)
BUT4: buttons (R52.1 SW5.2), mcu (R17.2)
BUT5: buttons (R53.1 SW6.2), mcu (R15.2)
BUT6: buttons (R54.1 SW7.2), mcu (R13.2)
BUT7: buttons (R55.1 SW8.2), mcu (R19.2)
C_IN1: main (J22.5), mcu (R08.2)
C_IN2: main (J22.7), mcu (R07.2)
C_IN3: main (J22.8), mcu (R06.2)
DC/RS: mcu (U1.25), lcd (J5.5)
LCD_PWM: mcu (U1.30), lcd (J5.8)
NetColdRST_2: buttons (ColdRST.2 R56.1), mcu (U7.4)
NetJ3_6: main (J3.6), mcu (R31.2)
NetJ3_7: main (J3.7), mcu (R32.2)
NetJ5_3: mcu (R25.2 R26.1), lcd (J5.3)
NetJ6_2: main (J6.2), mcu (R23.1 R24.2), rtc (U9.15)
NetJ6_3: main (J6.3), mcu (R21.2 R22.1), rtc (U9.16)
NetR09_2: mcu (R09.2), rs485 (U5.3)
NetR10_2: mcu (R10.2), rs485 (U5.6)
NetR11_2: mcu (R11.2), rs485 (U5.5)
NetR12_2: mcu (R12.2), rs485 (U5.4)
NetR58_1: main (R58.1), rtc (U9.4)
nRST: main (J3.10 R58.2), buttons (R57.1 WarmRST.2), mcu (U1.116), rs485 (U5.7), lcd (J5.4)
RTC_INT: mcu (U1.55), rtc (U9.3)
SPI_CLK: mcu (U1.95), lcd (J5.7)
SPI_ENA: mcu (U1.96), lcd (R59.2 R60.1)
SPI_MISO: mcu (U1.94), lcd (J5.9)
SPI_MOSI: mcu (U1.93), lcd (J5.6)
TCK: main (J3.4), mcu (R35.1 R36.2 U1.112)
TDI: main (J3.8), mcu (R34.1 U1.110)
TMS: main (J3.2), mcu (R33.1 U1.108)
V_IN1: main (J22.2), mcu (R05.2)
V_IN2: main (J22.1), mcu (R04.2)
V_IN3: main (J22.3), mcu (R03.2)